# Altium schematic sheet ControlePotencia.SchDoc: CONTROLADORA AIRPOPCORN
size A3; DocumentNumber: 10; SheetNumber: 10; SheetTotal: 15
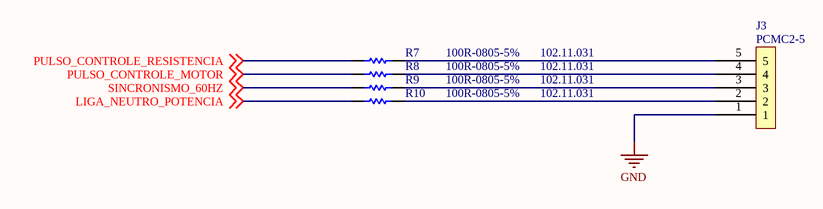
[diagram p0: ControlePotencia.SchDoc]

## Parts
J3  PCMC2-5  [PCMC2-5]
R7  100R-0805-5%  ERP: 102.11.031  [0805-REVISADO ONDA]
R8  100R-0805-5%  ERP: 102.11.031  [0805-REVISADO ONDA]
R9  100R-0805-5%  ERP: 102.11.031  [0805-REVISADO ONDA]
R10  100R-0805-5%  ERP: 102.11.031  [0805-REVISADO ONDA]

## Nets
GND: J3.1
LIGA_NEUTRO_POTENCIA: R10.1 ; off-sheet LIGA_NEUTRO_POTENCIA
PULSO_CONTROLE_MOTOR: R8.1 ; off-sheet PULSO_CONTROLE_MOTOR
PULSO_CONTROLE_RESISTENCIA: R7.1 ; off-sheet PULSO_CONTROLE_RESISTENCIA
SINCRONISMO_60HZ: R9.1 ; off-sheet SINCRONISMO_60HZ
NetJ3_2: J3.2 R10.2
NetJ3_3: J3.3 R9.2
NetJ3_4: J3.4 R8.2
NetJ3_5: J3.5 R7.2

## Notes on the sheet
- NOME
- DATA
- PROJETO
- DESCRIÇÃO
- desenho
- verif.
- aprov.
- TAMANHO
- CODIGO
- Todas as informações disponíveis
- não devem ser divulgadas,
- em parte ou todo.
- CIRCUITO IMPRESSO
- MONTAGEM ELETRÔNICA
- A4
- de